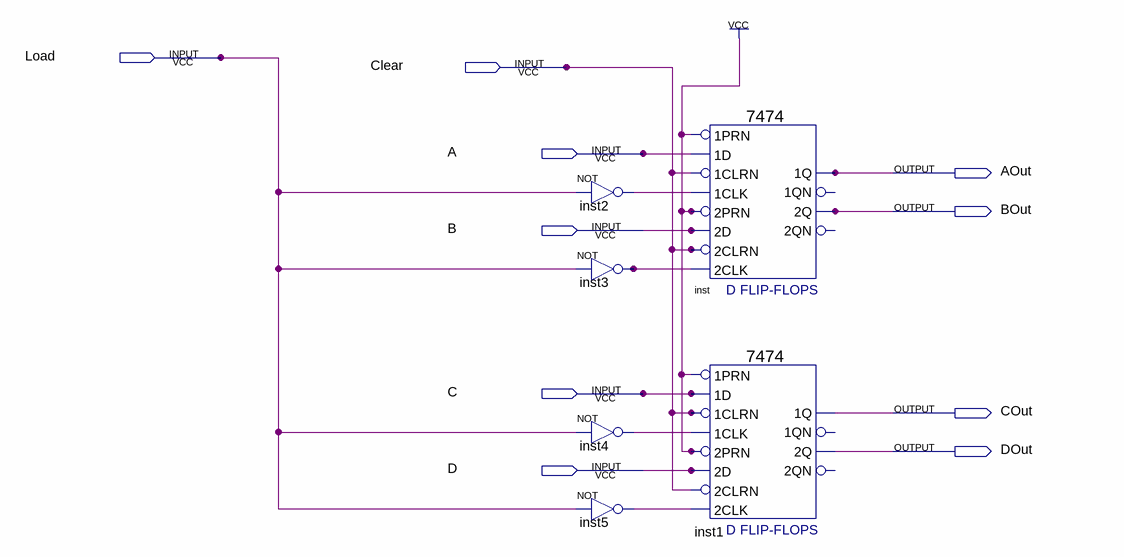
[diagram p0: schematic sheet]
// Quartus schematic 7474reg.bdf as structural Verilog: 6 symbols, 10 pins
module \7474reg  (
  input  Load,
  input  Clear,
  input  A,
  input  B,
  input  C,
  input  D,
  output AOut,
  output BOut,
  output COut,
  output DOut
);

  wire inst2_out, inst3_out, inst4_out, inst5_out;

  not inst2 (inst2_out, Load);
  not inst3 (inst3_out, Load);
  not inst4 (inst4_out, Load);
  not inst5 (inst5_out, Load);
  \7474  inst (
    .\2D (B), .\2PRN (1'b1), .\1CLK (inst2_out), .\1D (A), .\1PRN (1'b1), .\2CLK (inst3_out),
    .\2CLRN (Clear), .\1CLRN (Clear), .\2Q (BOut), .\1Q (AOut));  // open: 1QN, 2QN
  \7474  inst1 (
    .\2D (D), .\2PRN (1'b1), .\1CLK (inst4_out), .\1D (C), .\1PRN (1'b1), .\2CLK (inst5_out),
    .\2CLRN (Clear), .\1CLRN (Clear), .\2Q (DOut), .\1Q (COut));  // open: 1QN, 2QN
endmodule
